# EAGLE design IZU2023_board2_ver4 (EAGLE 9.6.2)
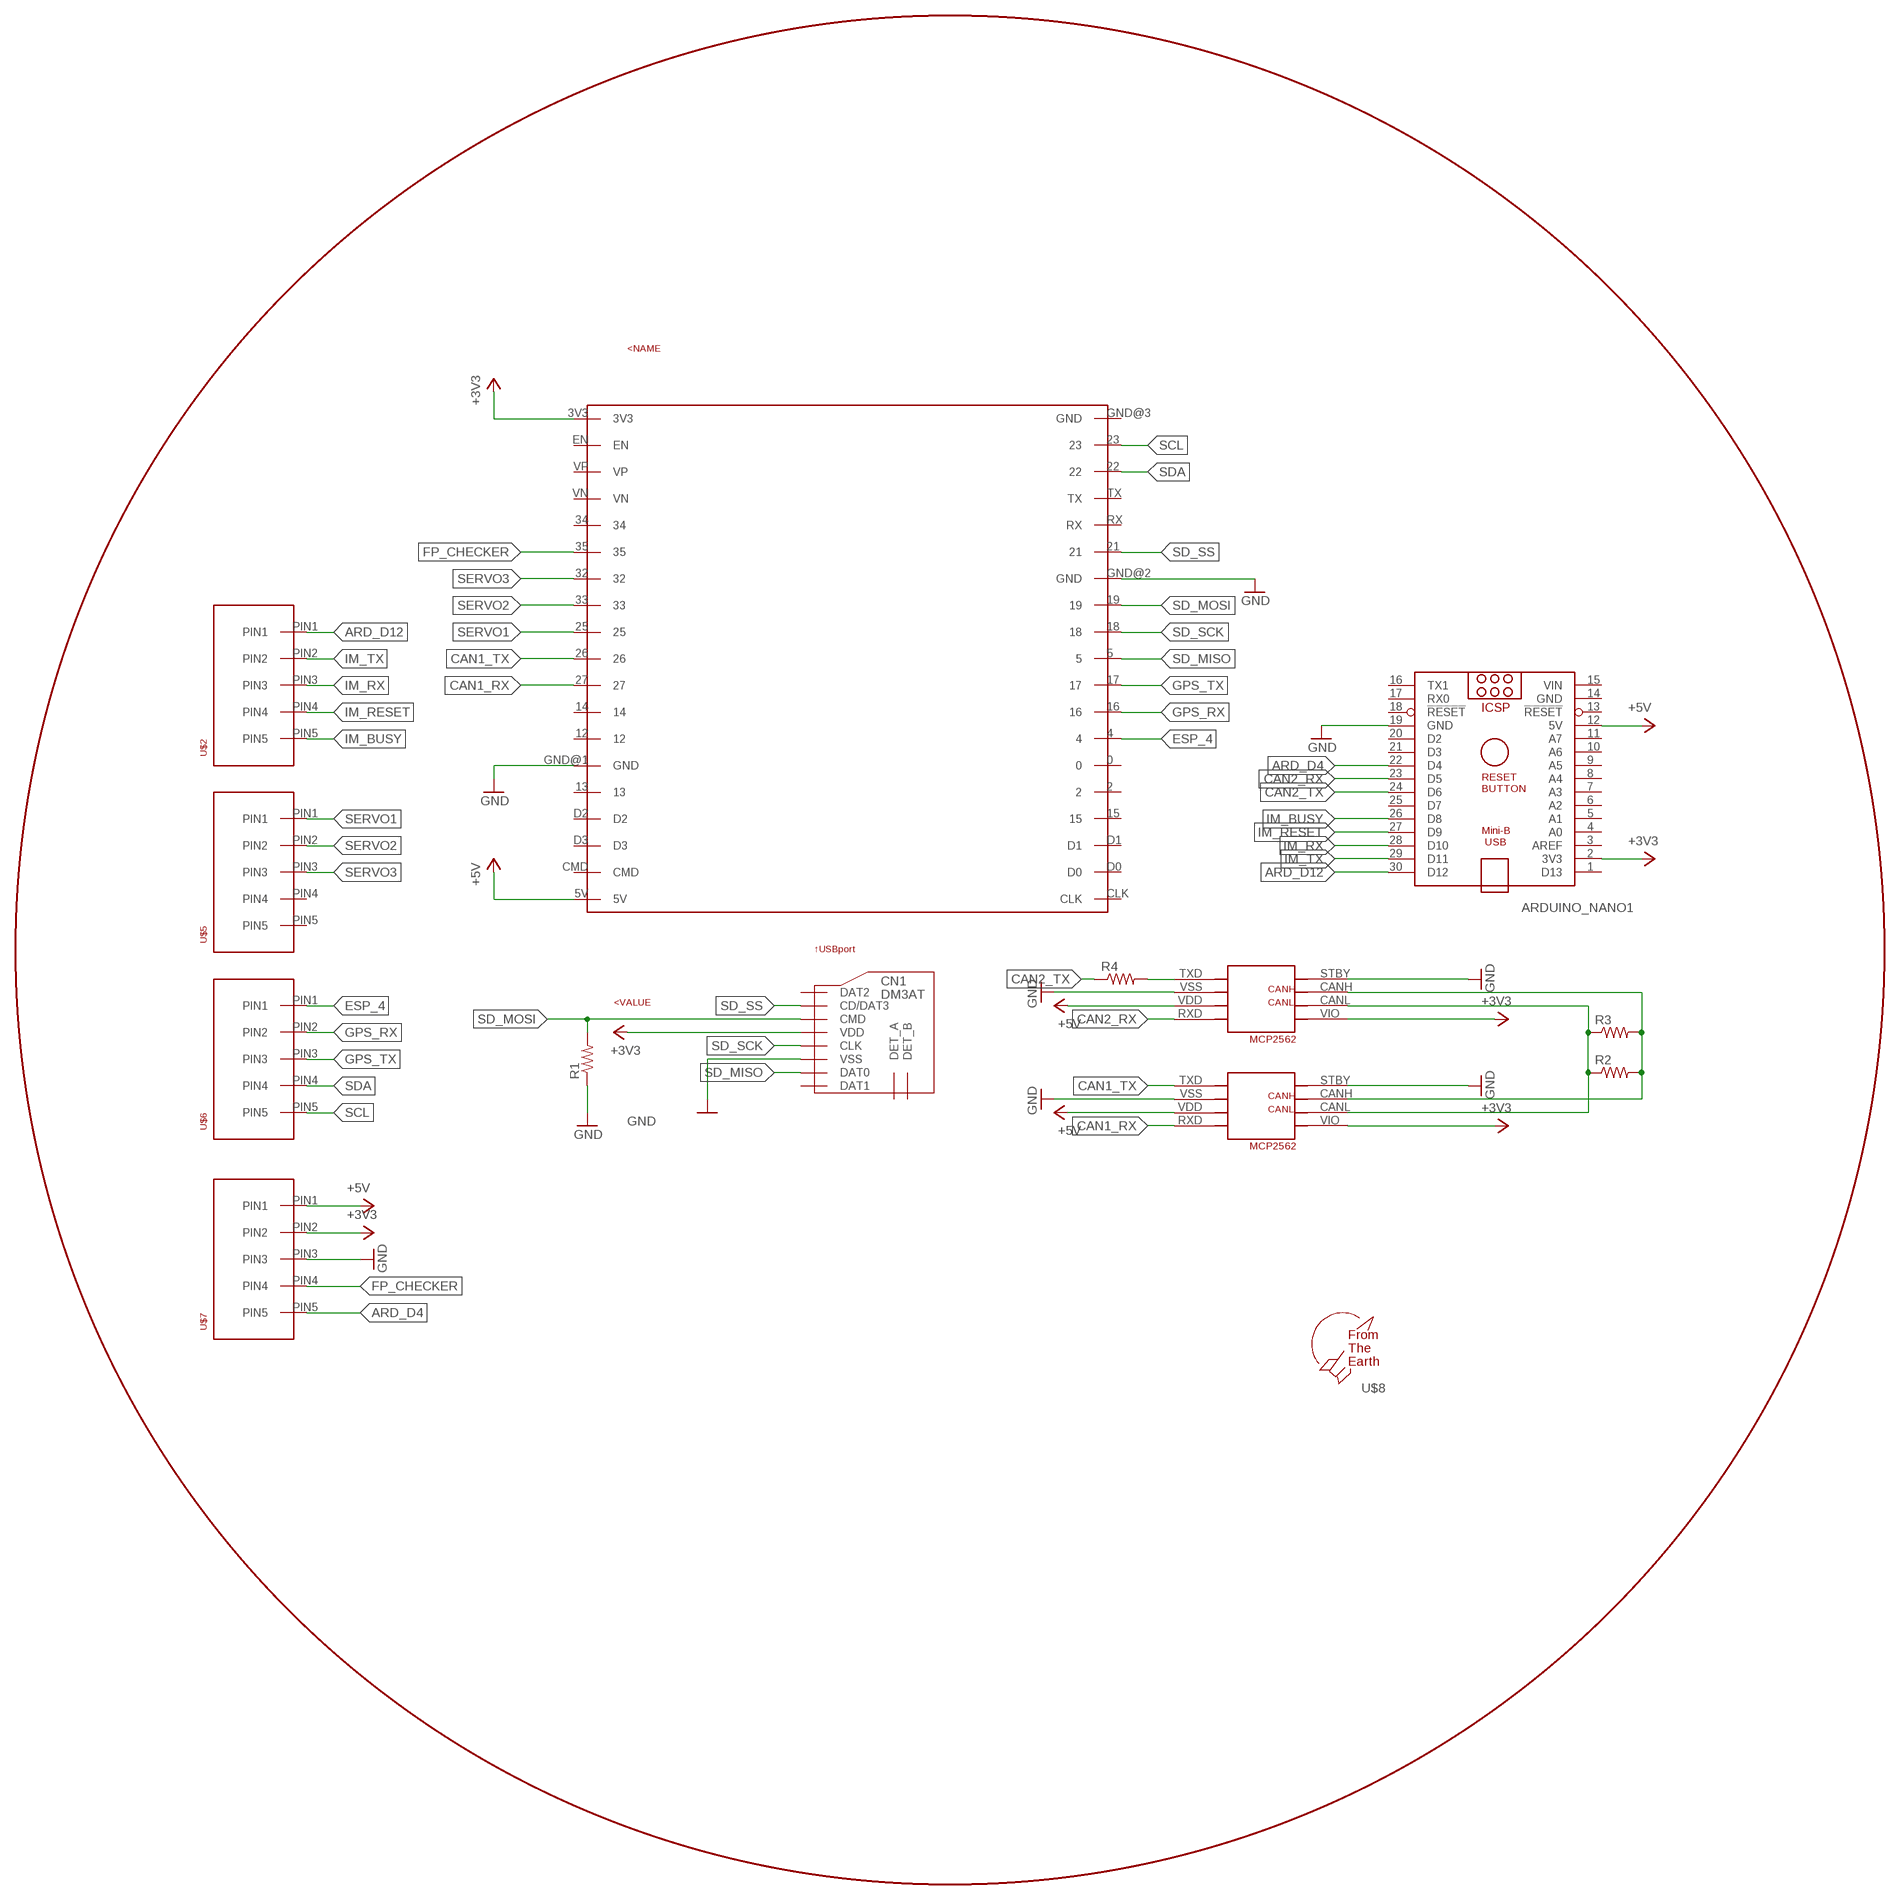
[diagram p0: schematic, sheet 1]

## Parts
ARDUINO_NANO1  ARDUINO_NANO  [ARDUINO_NANO]
CN1  DM3AT  [DM3AT]
R1  R-US_0204/7  [0204/7]
R2  R-US_0204/7  [0204/7]
R3  R-US_0204/7  [0204/7]
R4  R-US_0204/7  [0204/7]
U$1  ESP32-DEVKITC  [ESP32-DEVKITC]
U$2  5PIN  [5PIN]
U$3  MCP2562  [MCP2562]
U$4  MCP2562  [MCP2562]
U$5  5PIN  [5PIN]
U$6  5PIN  [5PIN]
U$7  5PIN  [5PIN]
U$8  F.T.E.LOGO  [LOGO]

## Nets
+3V3: ARDUINO_NANO1.2(3V3) CN1.VDD U$1.3V3 U$3.VIO U$4.VIO U$7.PIN2
+5V: ARDUINO_NANO1.12(5V) U$1.5V U$3.VDD U$4.VDD U$7.PIN1
ARD_D4: ARDUINO_NANO1.22(D4) U$7.PIN5
ARD_D12: ARDUINO_NANO1.30(D12) U$2.PIN1
CAN1_RX: U$1.27 U$3.RXD
CAN1_TX: U$1.26 U$3.TXD
CAN2_RX: ARDUINO_NANO1.23(D5) U$4.RXD
CAN2_TX: ARDUINO_NANO1.24(D6) R4.1
ESP_4: U$1.4 U$6.PIN1
FP_CHECKER: U$1.35 U$7.PIN4
GND: ARDUINO_NANO1.19(GND) CN1.VSS R1.1 U$1.GND@1(GND) U$1.GND@2(GND) U$3.STBY U$3.VSS U$4.STBY U$4.VSS U$7.PIN3
GPS_RX: U$1.16 U$6.PIN2
GPS_TX: U$1.17 U$6.PIN3
IM_BUSY: ARDUINO_NANO1.26(D8) U$2.PIN5
IM_RESET: ARDUINO_NANO1.27(D9) U$2.PIN4
IM_RX: ARDUINO_NANO1.28(D10) U$2.PIN3
IM_TX: ARDUINO_NANO1.29(D11) U$2.PIN2
N$1: R4.2 U$4.TXD
N$3: R2.1 R3.1 U$3.CANL U$4.CANL
N$4: R2.2 R3.2 U$3.CANH U$4.CANH
SCL: U$1.23 U$6.PIN5
SD_MISO: CN1.DAT0 U$1.5
SD_MOSI: CN1.CMD R1.2 U$1.19
SD_SCK: CN1.CLK U$1.18
SD_SS: CN1.CD/DAT3 U$1.21
SDA: U$1.22 U$6.PIN4
SERVO1: U$1.25 U$5.PIN1
SERVO2: U$1.33 U$5.PIN2
SERVO3: U$1.32 U$5.PIN3
Unconnected: ARDUINO_NANO1.1(D13) ARDUINO_NANO1.3(AREF) ARDUINO_NANO1.4(A0) ARDUINO_NANO1.5(A1) ARDUINO_NANO1.6(A2) ARDUINO_NANO1.7(A3) ARDUINO_NANO1.8(A4) ARDUINO_NANO1.9(A5) ARDUINO_NANO1.10(A6) ARDUINO_NANO1.11(A7) ARDUINO_NANO1.13(!RESET) ARDUINO_NANO1.16(TX1) ARDUINO_NANO1.17(RX0) ARDUINO_NANO1.18(!RESET) ARDUINO_NANO1.20(D2) ARDUINO_NANO1.21(D3) ARDUINO_NANO1.25(D7) CN1.DAT1 CN1.DAT2 CN1.DET_A CN1.DET_B U$1.0 U$1.2 U$1.12 U$1.13 U$1.14 U$1.15 U$1.34 U$1.CLK U$1.CMD U$1.D0 U$1.D1 U$1.D2 U$1.D3 U$1.EN U$1.GND@3(GND) U$1.RX U$1.TX U$1.VN U$1.VP U$5.PIN4 U$5.PIN5

## Power pins joined to a net without a drawn wire
GND: ARDUINO_NANO1.14(GND)
VIN: ARDUINO_NANO1.15(VIN)

## Library data of the parts
ARDUINO_NANO1 = ArduinoNanoV30:ARDUINO_NANO: Arduino Nano V3.0 Overview: The Arduino Nano is a small, complete, and breadboard-friendly board based on the ATmega328 (Arduino Nano 3.x) or ATmega168 (Arduino Nano 2.x). It has more or less the same functionality of the Arduino Duemilanove, but in a different package. It lacks only a DC power jack, and works with a Mini-B USB cable instead of a standard one. The Nano was designed and is being produced by Gravitech. Specifications: Microcontroller Atmel ATmega168 or ATmega328 Operating Voltage (logic level) 5 V Input Voltage (recommended) 7-12 V Input Voltage (limits) 6-20 V Digital I/O Pins 14 (of which 6 provide PWM output) Analog Input Pins 8 DC Current per I/O Pin 40 mA Flash Memory 16 KB (ATmega168) or 32 KB (ATmega328) of which 2 KB used by bootloader SRAM 1 KB (ATmega168) or 2 KB (ATmega328) EEPROM 512 bytes (ATmega168) or 1 KB (ATmega328) Clock Speed 16 MHz Dimensions 0.73" x 1.70" Length 45 mm Width 18 mm Weigth 5 g Power: The Arduino Nano can be powered via the Mini-B USB connection, 6-20V unregulated external power supply (pin 30), or 5V regulated external power supply (pin 27). The power source is automatically selected to the highest voltage source. Memory: The ATmega168 has 16 KB of flash memory for storing code (of which 2 KB is used for the bootloader); the ATmega328 has 32 KB, (also with 2 KB used for the bootloader). The ATmega168 has 1 KB of SRAM and 512 bytes of EEPROM (which can be read and written with the EEPROM library); the ATmega328 has 2 KB of SRAM and 1 KB of EEPROM. Input and Output: Each of the 14 digital pins on the Nano can be used as an input or output, using pinMode(), digitalWrite(), and digitalRead() functions. They operate at 5 volts. Each pin can provide or receive a maximum of 40 mA and has an internal pull-up resistor (disconnected by default) of 20-50 kOhms. In addition, some pins have specialized functions. Visit Arduino - ArduinoBoardNano <https://www.arduino.cc/en/Main/ArduinoBoardNano>
CN1 = microSD:DM3AT
R1-R4 = rcl:R-US_: RESISTOR, American symbol; SPICEPREFIX: R
U$1 = ESP32-DevKitC:ESP32-DEVKITC
U$2 U$5-U$7 = connectors:5PIN
U$3 U$4 = MCP2562:MCP2562
U$8 = logo:F.T.E.LOGO

## Board
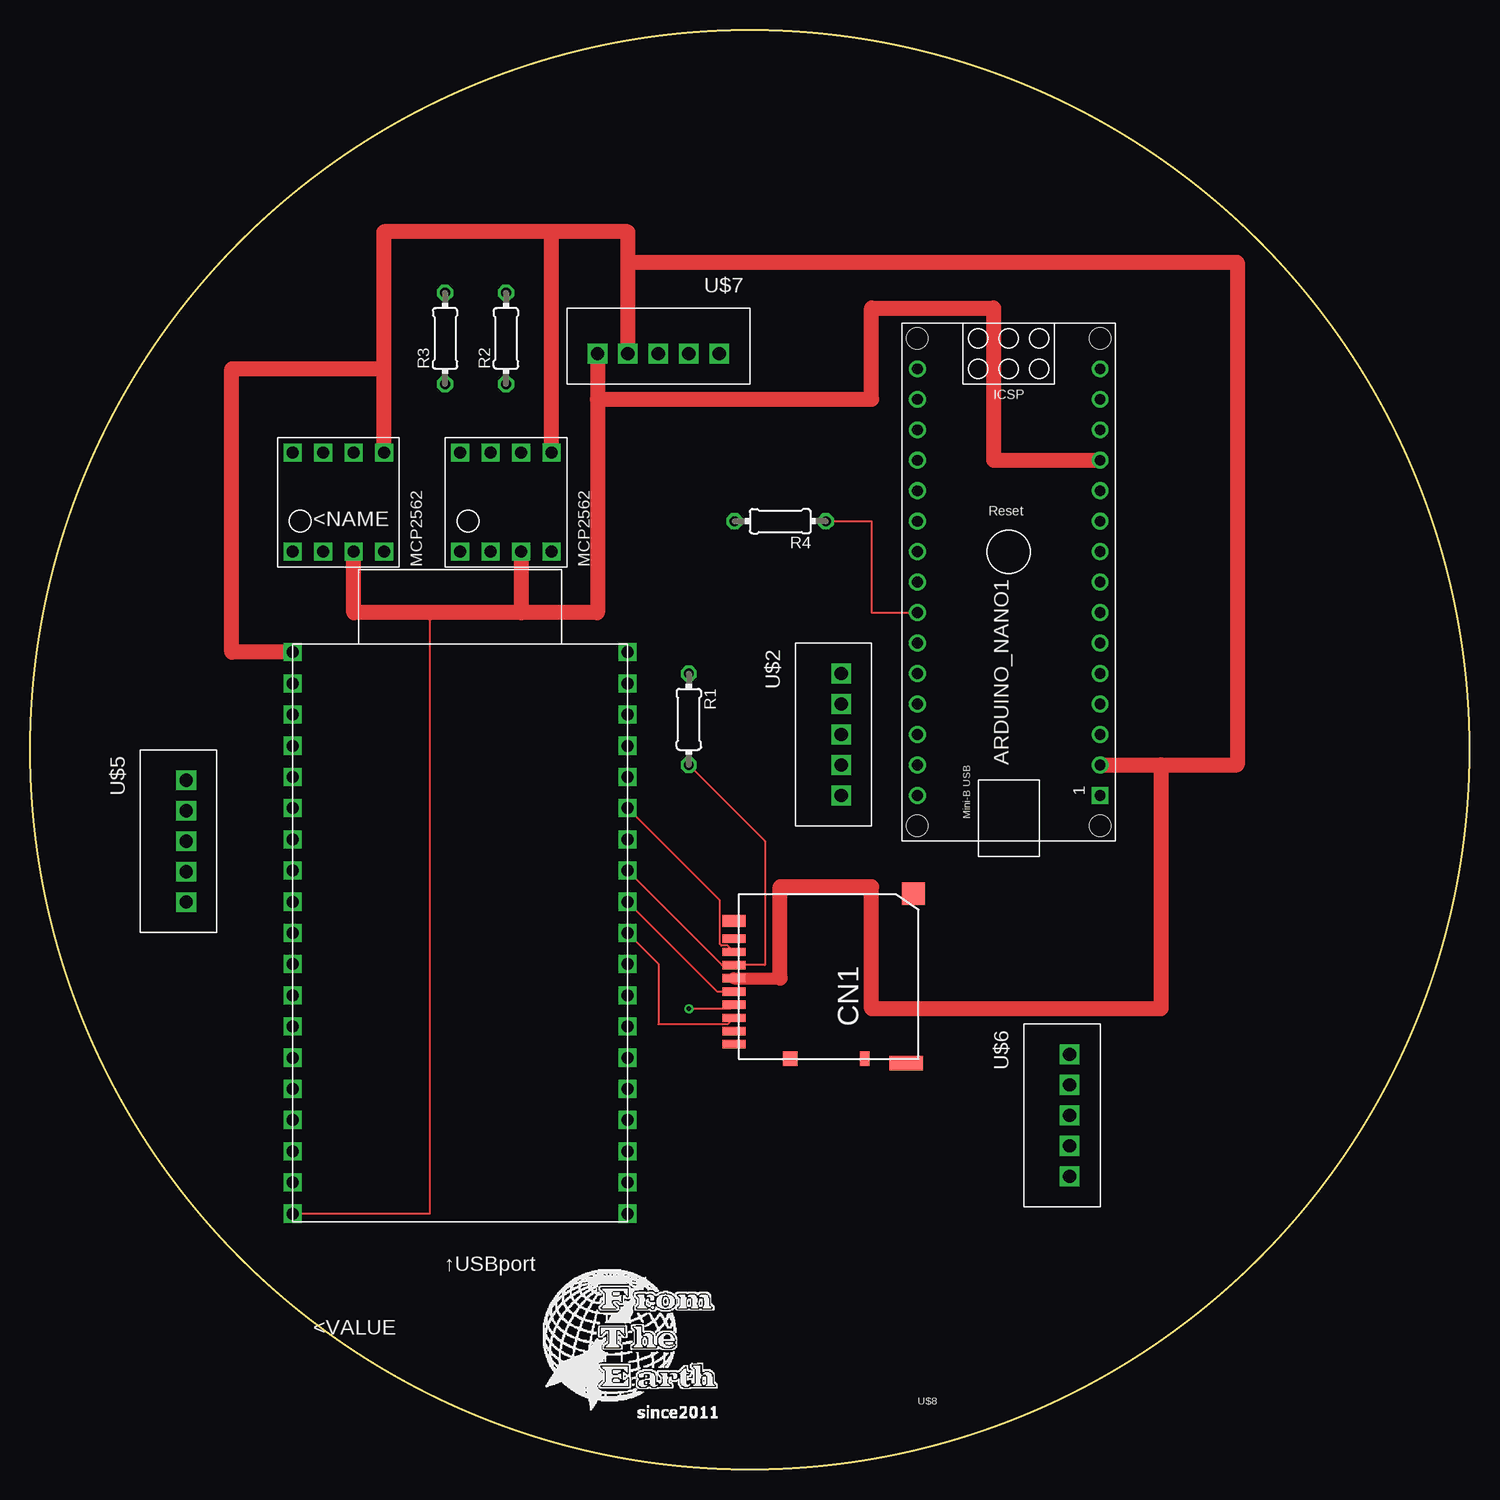
[diagram p1: board, top side]
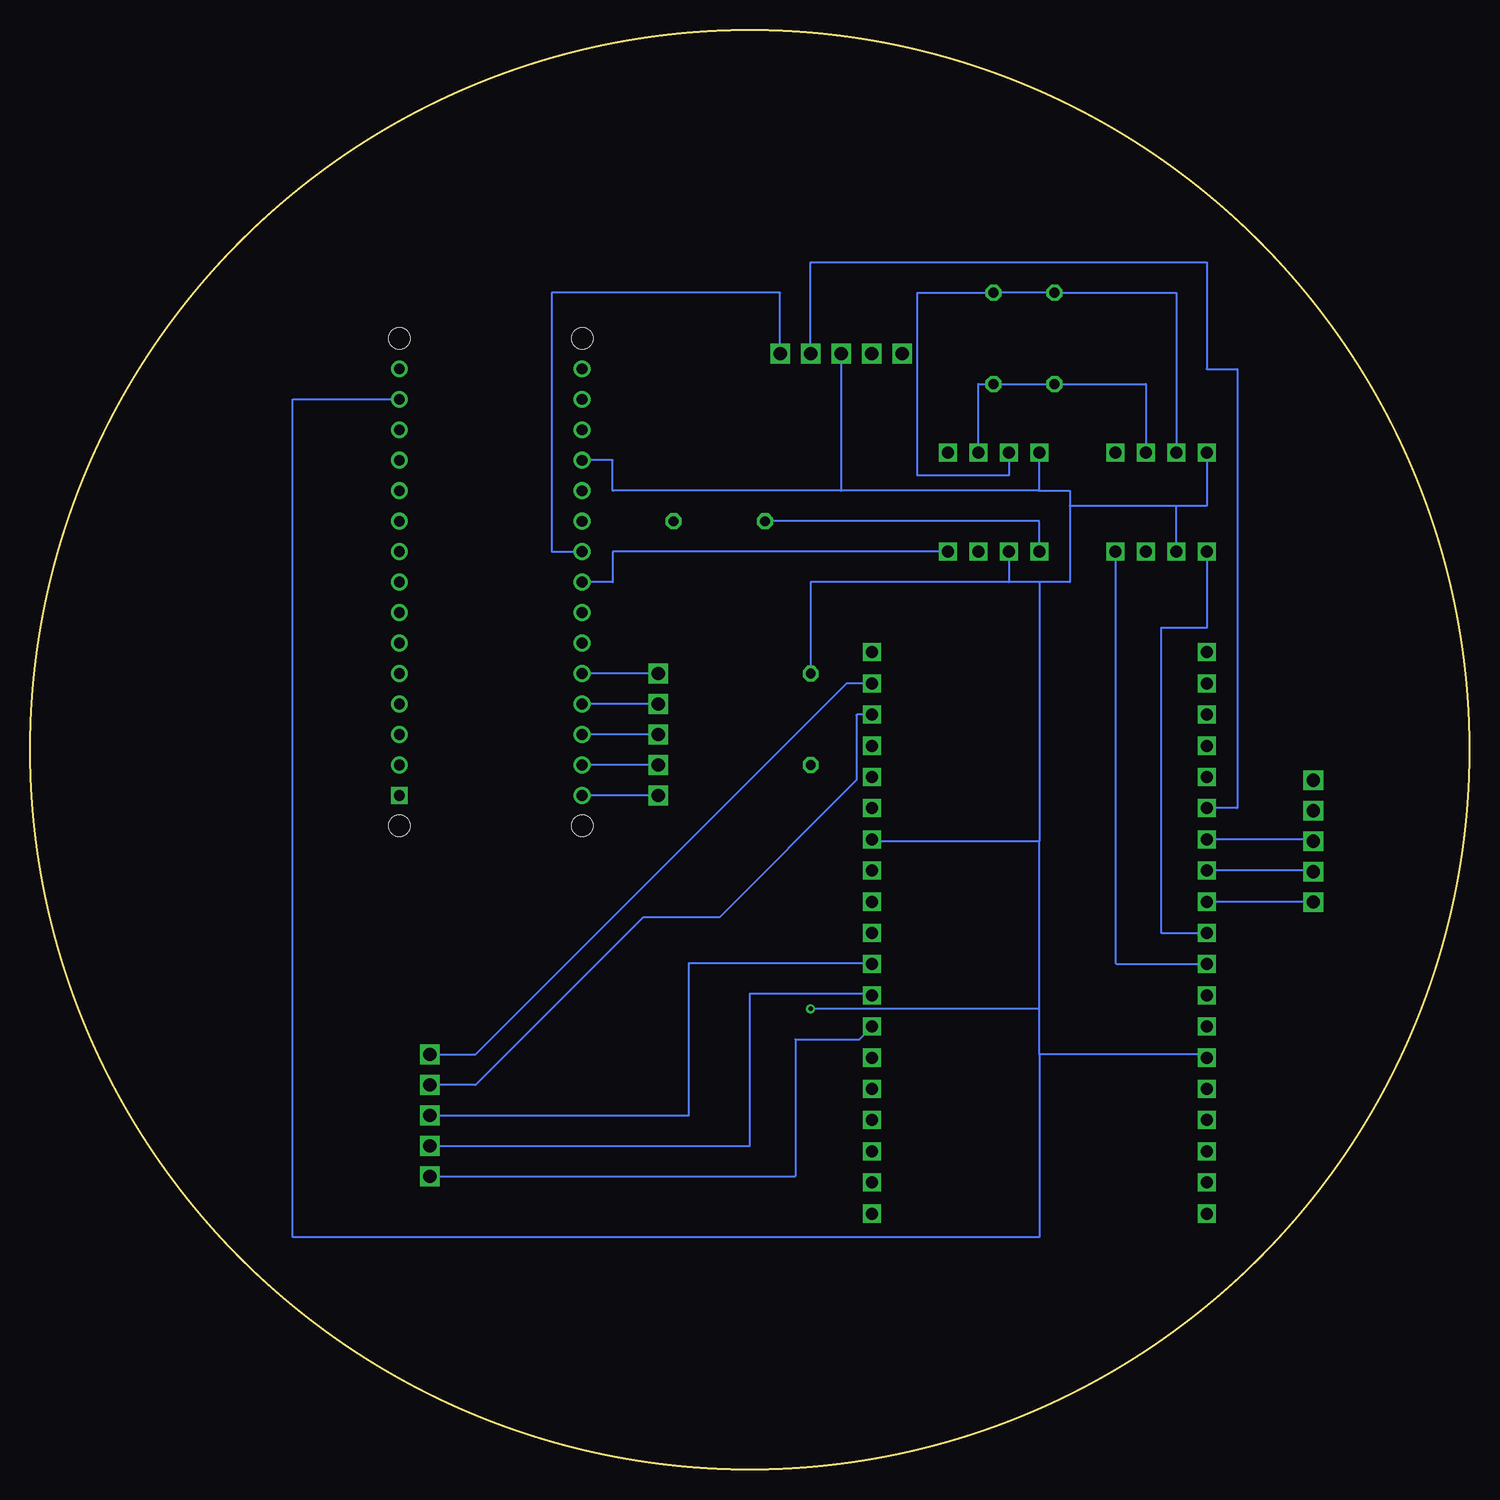
[diagram p2: board, bottom side, seen from below]

Size 120 x 120 mm. Coordinates in mm from the lower left corner, seen from the top.
Outline: circle at 60,60 radius 60
Copper layers (1*16): Top 0.035mm / dielectric 1.5mm / Bottom 0.035mm
Design rules "default": minimum track width 6mil, minimum drill 0.3mm, track to track 6mil, track to pad 6mil, pad to pad 6mil, via to via 6mil, smd to smd 6mil, copper to edge 0.5mm, drill to drill 0.5mm, minimum pad ring 10mil, minimum via ring 8mil, stop-mask expansion 4mil, vias tented up to drill 0mil, thermal gap 10mil

### Footprints (pad centres in the part's own frame; a part is rotated, then mirrored left to right if it is on the bottom)
ARDUINO_NANO = drill 0.9 square: 1 -20.32,-7.62 | drill 0.9: 2 -17.78,-7.62; 3 -15.24,-7.62; 4 -12.7,-7.62; 5 -10.16,-7.62; 6 -7.62,-7.62; 7 -5.08,-7.62; 8 -2.54,-7.62; 9 0,-7.62; 10 2.54,-7.62; 11 5.08,-7.62; 12 7.62,-7.62; 13 10.16,-7.62; 14 12.7,-7.62; 15 15.24,-7.62; 16 15.24,7.62; 17 12.7,7.62; 18 10.16,7.62; 19 7.62,7.62; 20 5.08,7.62; 21 2.54,7.62; 22 0,7.62; 23 -2.54,7.62; 24 -5.08,7.62; 25 -7.62,7.62; 26 -10.16,7.62; 27 -12.7,7.62; 28 -15.24,7.62; 29 -17.78,7.62; 30 -20.32,7.62 | hole 1.778: -22.86,-7.62; -22.86,7.62; 17.78,7.62; 17.78,-7.62
DM3AT = smd 0.7 x 1.9: CD/DAT3 2.2,6.4; CLK -1.1,6.4; CMD 1.1,6.4; DAT0 -3.3,6.4; DAT1 -4.4,6.4; DAT2 3.3,6.4; DET_B -5.5,6.4; VDD 0,6.4; VSS -2.2,6.4 | smd 1.2 x 0.8: DET_A -6.7,-4.5 | smd 1 x 1.9: P$9 4.8,6.381 | smd 1.2 x 1.2: P$11 -6.7,1.7 | smd 1.2 x 2.8: P$13 -7.081,-7.973 | smd 1.9 x 1.9: P$14 7.054,-8.562
0204/7 = drill 0.813 octagon: 1 -3.81,0; 2 3.81,0
ESP32-DEVKITC = drill 1 square: 0 27.9,13.7; 2 27.9,11.1; 3V3 0,47.5; 4 27.9,16.3; 5 27.9,24.1; 5V 0,0.7; 12 0,16.3; 13 0,11.1; 14 0,18.9; 15 27.9,8.5; 16 27.9,18.9; 17 27.9,21.5; 18 27.9,26.7; 19 27.9,29.3; 21 27.9,34.5; 22 27.9,42.3; 23 27.9,44.9; 25 0,26.7; 26 0,24.1; 27 0,21.5; 32 0,31.9; 33 0,29.3; 34 0,37.1; 35 0,34.5; CLK 27.9,0.7; CMD 0,3.3; D0 27.9,3.3; D1 27.9,5.9; D2 0,8.5; D3 0,5.9; EN 0,44.9; GND@1 0,13.7; GND@2 27.9,31.9; GND@3 27.9,47.5; RX 27.9,37.1; TX 27.9,39.7; VN 0,39.7; VP 0,42.3
5PIN = drill 1.1 square: PIN1 -5.08,-5.08; PIN2 -2.54,-5.08; PIN3 0,-5.08; PIN4 2.54,-5.08; PIN5 5.08,-5.08
MCP2562 = drill 1 square: CANH 8.255,6.35; CANL 8.255,3.81; RXD 0,1.27; STBY 8.255,8.89; TXD 0,8.89; VDD 0,3.81; VIO 8.255,1.27; VSS 0,6.35

### Placement (x,y rotation side)
ARDUINO_NANO1  81.59,76.51 90 top
CN1  65.08,40.95 90 top
R1  54.92,62.54 270 top
R2  39.68,94.29 90 top
R3  34.6,94.29 90 top
R4  62.54,79.05 180 top
U$1  21.9,20.63 0 top
U$2  62.54,61.27 90 top
U$3  30.79,76.51 90 top
U$4  44.76,76.51 90 top
U$5  7.93,52.38 90 top
U$6  81.59,29.52 90 top
U$7  52.38,98.1 0 top
U$8  42.22,2.85 0 top

### Tracks (layer width: path | path; a pad name or v marks a point on that pad's centre or on a via)
+3V3
  Top 1.016: CN1.VDD 62.54,40.95
  Top 1.27: U$7.PIN2 49.84,100.64 | 49.84,100.64 49.84,103.18 43.49,103.18 | 43.49,103.18 29.52,103.18 29.52,91.75 | 29.52,91.75 16.82,91.75 16.82,68.13 U$1.3V3 | 49.84,100.64 100.64,100.64 100.64,58.73 94.29,58.73 | U$4.VIO 43.49,103.18 | U$3.VIO 29.52,91.75 | ARDUINO_NANO1.2 94.29,58.73 | 94.29,58.73 94.29,38.41 70.16,38.41 70.16,48.57 62.54,48.57 62.54,40.95
+5V
  Top 0.152: 33.33,71.43 33.33,21.33 U$1.5V
  Top 1.27: U$7.PIN1 47.3,89.21 | 47.3,89.21 47.3,71.43 40.95,71.43 | 40.95,71.43 33.33,71.43 26.98,71.43 U$3.VDD | U$4.VDD 40.95,71.43 | 47.3,89.21 70.16,89.21 70.16,96.83 80.32,96.83 80.32,84.13 ARDUINO_NANO1.12
ARD_D4
  Bottom 0.152: U$7.PIN5 57.46,98.1 76.51,98.1 76.51,76.51 ARDUINO_NANO1.22
ARD_D12
  Bottom 0.152: U$2.PIN1 ARDUINO_NANO1.30
CAN1_RX
  Bottom 0.152: U$3.RXD 29.52,42.22 29.43,42.13 U$1.27
CAN1_TX
  Bottom 0.152: U$3.TXD 21.9,70.16 25.71,70.16 25.71,44.76 25.68,44.73 U$1.26
CAN2_RX
  Bottom 0.152: ARDUINO_NANO1.23 71.43,73.97 71.43,76.51 U$4.RXD
CAN2_TX
  Top 0.152: R4.1 70.16,79.05 70.16,71.43 ARDUINO_NANO1.24
ESP_4
  Bottom 0.152: U$6.PIN1 56.19,24.44 56.19,35.87 50.86,35.87 U$1.4
FP_CHECKER
  Bottom 0.152: U$7.PIN4 54.92,100.64 21.9,100.64 21.9,91.75 19.36,91.75 19.36,55.13 U$1.35
GND  (via drill 0.35)
  Top 0.152: CN1.VSS 58.34,38.41 v54.92,38.41
  Bottom 0.152: U$7.PIN3 52.38,81.59 | 35.87,81.59 52.38,81.59 | 35.87,81.59 U$4.STBY | 35.87,81.59 33.33,81.59 33.33,80.32 | 33.33,80.32 33.33,73.97 35.87,73.97 | R1.1 54.92,73.97 38.41,73.97 | 35.87,73.97 38.41,73.97 | U$4.VSS 38.41,73.97 | U$3.STBY 21.9,80.32 24.44,80.32 | 24.44,80.32 33.33,80.32 | U$3.VSS 24.44,80.32 | 35.87,73.97 35.87,52.38 | 35.87,52.38 49.84,52.38 49.84,52.49 U$1.GND@2 | U$1.GND@1 22.17,34.6 35.87,34.6 | 35.87,34.6 35.87,38.41 | 35.87,38.41 35.87,52.38 | 35.87,38.41 v54.92,38.41 | 52.38,81.59 71.43,81.59 71.43,84.13 ARDUINO_NANO1.19 | 35.87,34.6 35.87,19.36 98.1,19.36 98.1,89.21 ARDUINO_NANO1.14
GPS_RX
  Bottom 0.152: U$6.PIN2 60,26.98 60,39.68 49.95,39.68 U$1.16
GPS_TX
  Bottom 0.152: U$6.PIN3 65.08,29.52 65.08,42.22 49.89,42.22 U$1.17
IM_BUSY
  Bottom 0.152: U$2.PIN5 ARDUINO_NANO1.26
IM_RESET
  Bottom 0.152: U$2.PIN4 ARDUINO_NANO1.27
IM_RX
  Bottom 0.152: U$2.PIN3 ARDUINO_NANO1.28
IM_TX
  Bottom 0.152: U$2.PIN2 ARDUINO_NANO1.29
N$1
  Bottom 0.152: U$4.TXD 35.87,79.05 R4.2
N$3
  Bottom 0.152: U$4.CANL 40.95,90.48 R2.1 R3.1 26.98,90.48 U$3.CANL
N$4
  Bottom 0.152: U$4.CANH 38.41,82.86 46.03,82.86 46.03,98.1 R2.2 R3.2 24.44,98.1 U$3.CANH
SCL
  Bottom 0.152: U$1.23 51.93,65.53 82.86,34.6 U$6.PIN5
SD_MISO
  Top 0.152: U$1.5 52.38,42.15 52.38,37.14 58.17,37.14 CN1.DAT0
SD_MOSI
  Top 0.152: U$1.19 57.68,42.05 CN1.CMD 61.27,42.05 61.27,52.38 R1.2
SD_SCK
  Top 0.152: U$1.18 57.28,39.85 CN1.CLK
SD_SS
  Top 0.152: CN1.CD/DAT3 58.16,43.67 57.63,43.67 57.5,43.8 57.5,47.43 U$1.21
SDA
  Bottom 0.152: U$1.22 51.07,62.93 51.11,62.89 51.11,57.46 62.54,46.03 68.89,46.03 82.86,32.06 U$6.PIN4
SERVO1
  Bottom 0.152: U$5.PIN1 13.04,47.33 U$1.25
SERVO2
  Bottom 0.152: U$5.PIN2 13.1,49.93 U$1.33
SERVO3
  Bottom 0.152: U$5.PIN3 13.16,52.53 U$1.32